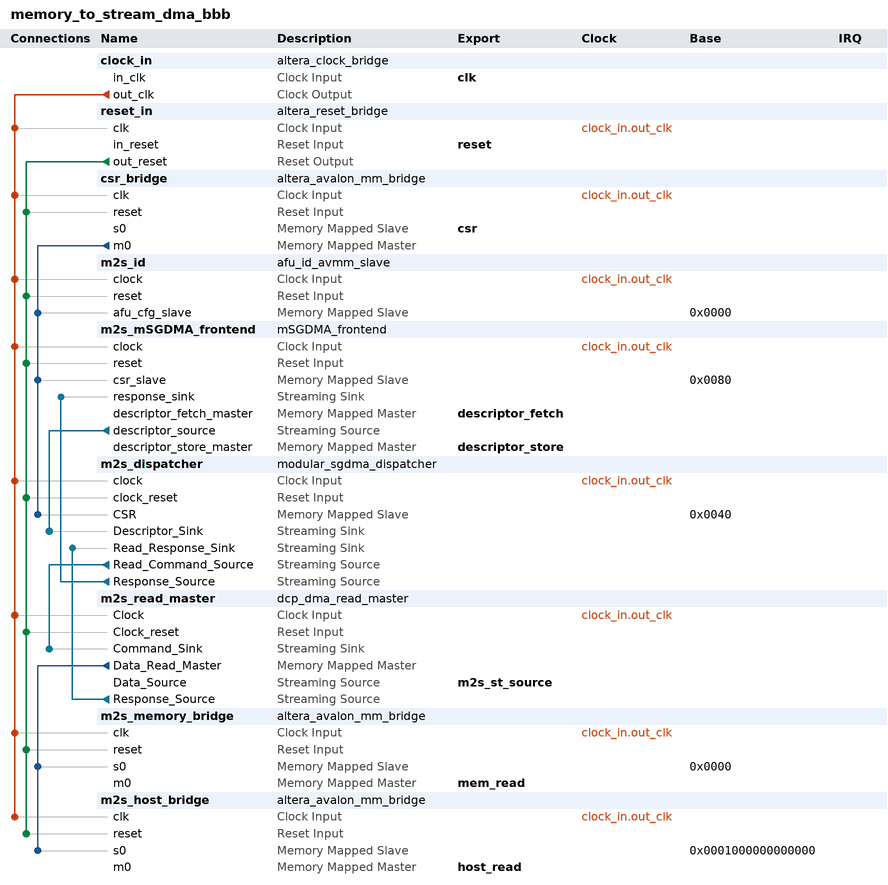
[diagram p0: system contents]
# Platform Designer (Qsys) system memory_to_stream_dma_bbb, Arria 10 10AX115N2F40E2LG
# Parameters at their usual value, and those the tool derives, are not listed.
package require -exact qsys 1.0
create_system memory_to_stream_dma_bbb
set_project_property DEVICE_FAMILY {Arria 10}
set_project_property DEVICE 10AX115N2F40E2LG

add_component clock_in ip/memory_to_stream_dma_bbb/memory_to_stream_dma_bbb_clock_in.ip altera_clock_bridge clock_in 17.1
load_component clock_in
set_component_parameter_value DERIVED_CLOCK_RATE 200000000
set_component_parameter_value EXPLICIT_CLOCK_RATE 200000000
save_component

add_component reset_in ip/memory_to_stream_dma_bbb/memory_to_stream_dma_bbb_reset_in.ip altera_reset_bridge reset_in 17.1
load_component reset_in
set_component_parameter_value ACTIVE_LOW_RESET 0
set_component_parameter_value SYNCHRONOUS_EDGES both
save_component

add_component csr_bridge ip/memory_to_stream_dma_bbb/memory_to_stream_dma_bbb_csr_bridge.ip altera_avalon_mm_bridge csr_bridge 17.1

add_component m2s_id ip/memory_to_stream_dma_bbb/memory_to_stream_dma_bbb_id.ip afu_id_avmm_slave m2s_id 1.0
load_component m2s_id
set_component_parameter_value AFU_ID_H 18367538847433573357
set_component_parameter_value AFU_ID_L 11526008376138818357
set_component_parameter_value DFH_FEATURE_TYPE 2
set_component_parameter_value DFH_AFU_MINOR_REV 0
set_component_parameter_value DFH_AFU_MAJOR_REV 0
set_component_parameter_value DFH_END_OF_LIST 0
set_component_parameter_value DFH_NEXT_OFFSET 256
set_component_parameter_value DFH_FEATURE_ID 0
set_component_parameter_value NEXT_AFU_OFFSET 0
set_component_parameter_value CREATE_SCRATCH_REG 0
save_component

add_component m2s_mSGDMA_frontend ip/memory_to_stream_dma_bbb/memory_to_stream_dma_bbb_mSGDMA_frontend.ip mSGDMA_frontend m2s_mSGDMA_frontend 1.0

add_component m2s_dispatcher ip/memory_to_stream_dma_bbb/memory_to_stream_dma_bbb_dispatcher.ip modular_sgdma_dispatcher m2s_dispatcher 17.1
load_component m2s_dispatcher
set_component_parameter_value PREFETCHER_USE_CASE 1
set_component_parameter_value MODE 1
set_component_parameter_value GUI_RESPONSE_PORT 0
set_component_parameter_value RESPONSE_PORT 1
set_component_parameter_value DESCRIPTOR_INTERFACE 1
set_component_parameter_value DESCRIPTOR_FIFO_DEPTH 32
set_component_parameter_value ENHANCED_FEATURES 1
set_component_parameter_value DESCRIPTOR_WIDTH 256
set_component_parameter_value DESCRIPTOR_BYTEENABLE_WIDTH 32
set_component_parameter_value CSR_ADDRESS_WIDTH 3
set_component_parameter_value DATA_WIDTH 32
set_component_parameter_value DATA_WIDTH_DERIVED 2
set_component_parameter_value DATA_FIFO_DEPTH 32
set_component_parameter_value DATA_FIFO_DEPTH_DERIVED 1
set_component_parameter_value MAX_BYTE 1024
set_component_parameter_value MAX_BYTE_DERIVED 0
set_component_parameter_value TRANSFER_TYPE {Aligned Accesses}
set_component_parameter_value TRANSFER_TYPE_DERIVED 1
set_component_parameter_value BURST_ENABLE 0
set_component_parameter_value MAX_BURST_COUNT 2
set_component_parameter_value MAX_BURST_COUNT_DERIVED 0
set_component_parameter_value BURST_WRAPPING_SUPPORT 0
set_component_parameter_value STRIDE_ENABLE 0
set_component_parameter_value STRIDE_ENABLE_DERIVED 0
set_component_parameter_value MAX_STRIDE 1
set_component_parameter_value MAX_STRIDE_DERIVED 0
set_component_parameter_value PROGRAMMABLE_BURST_ENABLE 0
set_component_parameter_value CHANNEL_ENABLE 0
set_component_parameter_value CHANNEL_WIDTH 8
set_component_parameter_value CHANNEL_WIDTH_DERIVED 7
set_component_parameter_value ERROR_ENABLE 0
set_component_parameter_value ERROR_WIDTH 8
set_component_parameter_value ERROR_WIDTH_DERIVED 7
set_component_parameter_value PACKET_ENABLE 0
set_component_parameter_value DESCRIPTOR_FIFO_DEPTH_DERIVED 2
save_component

add_component m2s_read_master ip/memory_to_stream_dma_bbb/memory_to_stream_dma_bbb_dma_read_master.ip dcp_dma_read_master m2s_read_master 17.1
load_component m2s_read_master
set_component_parameter_value DATA_WIDTH 512
set_component_parameter_value LENGTH_WIDTH 31
set_component_parameter_value FIFO_DEPTH 256
set_component_parameter_value USE_FIX_ADDRESS_WIDTH 1
set_component_parameter_value FIX_ADDRESS_WIDTH 49
set_component_parameter_value STRIDE_ENABLE 0
set_component_parameter_value GUI_STRIDE_WIDTH 1
set_component_parameter_value BURST_ENABLE 1
set_component_parameter_value GUI_MAX_BURST_COUNT 4
set_component_parameter_value GUI_PROGRAMMABLE_BURST_ENABLE 0
set_component_parameter_value GUI_BURST_WRAPPING_SUPPORT 1
set_component_parameter_value TRANSFER_TYPE {Aligned Accesses}
set_component_parameter_value PACKET_ENABLE 1
set_component_parameter_value ERROR_ENABLE 0
set_component_parameter_value ERROR_WIDTH 8
set_component_parameter_value CHANNEL_ENABLE 0
set_component_parameter_value CHANNEL_WIDTH 8
set_component_parameter_value BYTE_ENABLE_WIDTH 64
set_component_parameter_value BYTE_ENABLE_WIDTH_LOG2 6
set_component_parameter_value ADDRESS_WIDTH 49
set_component_parameter_value FIFO_DEPTH_LOG2 8
set_component_parameter_value SYMBOL_WIDTH 8
set_component_parameter_value NUMBER_OF_SYMBOLS 64
set_component_parameter_value NUMBER_OF_SYMBOLS_LOG2 6
set_component_parameter_value MAX_BURST_COUNT_WIDTH 3
set_component_parameter_value UNALIGNED_ACCESSES_ENABLE 0
set_component_parameter_value ONLY_FULL_ACCESS_ENABLE 0
set_component_parameter_value BURST_WRAPPING_SUPPORT 1
set_component_parameter_value PROGRAMMABLE_BURST_ENABLE 0
set_component_parameter_value MAX_BURST_COUNT 4
set_component_parameter_value FIFO_SPEED_OPTIMIZATION 1
set_component_parameter_value STRIDE_WIDTH 1
save_component

add_component m2s_memory_bridge ip/memory_to_stream_dma_bbb/memory_to_stream_dma_bbb_memory_bridge.ip altera_avalon_mm_bridge m2s_memory_bridge 17.1

add_component m2s_host_bridge ip/memory_to_stream_dma_bbb/memory_to_stream_dma_bbb_host_bridge.ip altera_avalon_mm_bridge m2s_host_bridge 17.1
load_component m2s_host_bridge
set_component_parameter_value DATA_WIDTH 512
set_component_parameter_value ADDRESS_WIDTH 48
set_component_parameter_value USE_AUTO_ADDRESS_WIDTH 0
set_component_parameter_value ADDRESS_UNITS SYMBOLS
set_component_parameter_value MAX_BURST_SIZE 4
set_component_parameter_value MAX_PENDING_RESPONSES 32
save_component

# connections
add_connection clock_in.out_clk csr_bridge.clk clock
add_connection clock_in.out_clk m2s_dispatcher.clock clock
add_connection clock_in.out_clk m2s_host_bridge.clk clock
add_connection clock_in.out_clk m2s_id.clock clock
add_connection clock_in.out_clk m2s_memory_bridge.clk clock
add_connection clock_in.out_clk m2s_mSGDMA_frontend.clock clock
add_connection clock_in.out_clk m2s_read_master.Clock clock
add_connection clock_in.out_clk reset_in.clk clock
add_connection reset_in.out_reset csr_bridge.reset reset
add_connection reset_in.out_reset m2s_dispatcher.clock_reset reset
add_connection reset_in.out_reset m2s_host_bridge.reset reset
add_connection reset_in.out_reset m2s_id.reset reset
add_connection reset_in.out_reset m2s_memory_bridge.reset reset
add_connection reset_in.out_reset m2s_mSGDMA_frontend.reset reset
add_connection reset_in.out_reset m2s_read_master.Clock_reset reset
add_connection csr_bridge.m0 m2s_dispatcher.CSR avalon
set_connection_parameter_value csr_bridge.m0/m2s_dispatcher.CSR baseAddress 0x0040
add_connection csr_bridge.m0 m2s_id.afu_cfg_slave avalon
set_connection_parameter_value csr_bridge.m0/m2s_id.afu_cfg_slave baseAddress 0x0000
add_connection csr_bridge.m0 m2s_mSGDMA_frontend.csr_slave avalon
set_connection_parameter_value csr_bridge.m0/m2s_mSGDMA_frontend.csr_slave baseAddress 0x0080
add_connection m2s_read_master.Data_Read_Master m2s_host_bridge.s0 avalon
set_connection_parameter_value m2s_read_master.Data_Read_Master/m2s_host_bridge.s0 baseAddress 0x0001000000000000
add_connection m2s_read_master.Data_Read_Master m2s_memory_bridge.s0 avalon
set_connection_parameter_value m2s_read_master.Data_Read_Master/m2s_memory_bridge.s0 baseAddress 0x0000
add_connection m2s_dispatcher.Read_Command_Source m2s_read_master.Command_Sink avalon_streaming
add_connection m2s_dispatcher.Response_Source m2s_mSGDMA_frontend.response_sink avalon_streaming
add_connection m2s_mSGDMA_frontend.descriptor_source m2s_dispatcher.Descriptor_Sink avalon_streaming
add_connection m2s_read_master.Response_Source m2s_dispatcher.Read_Response_Sink avalon_streaming

# exported interfaces
add_interface clk clock sink
set_interface_property clk EXPORT_OF clock_in.in_clk
add_interface csr avalon slave
set_interface_property csr EXPORT_OF csr_bridge.s0
add_interface descriptor_fetch avalon master
set_interface_property descriptor_fetch EXPORT_OF m2s_mSGDMA_frontend.descriptor_fetch_master
add_interface descriptor_store avalon master
set_interface_property descriptor_store EXPORT_OF m2s_mSGDMA_frontend.descriptor_store_master
add_interface host_read avalon master
set_interface_property host_read EXPORT_OF m2s_host_bridge.m0
add_interface m2s_st_source avalon_streaming source
set_interface_property m2s_st_source EXPORT_OF m2s_read_master.Data_Source
add_interface mem_read avalon master
set_interface_property mem_read EXPORT_OF m2s_memory_bridge.m0
add_interface reset reset sink
set_interface_property reset EXPORT_OF reset_in.in_reset

set_interconnect_requirement {$system} qsys_mm.clockCrossingAdapter HANDSHAKE
set_interconnect_requirement {$system} qsys_mm.enableEccProtection FALSE
set_interconnect_requirement {$system} qsys_mm.insertDefaultSlave FALSE
set_interconnect_requirement {$system} qsys_mm.maxAdditionalLatency 1

save_system memory_to_stream_dma_bbb.qsys
